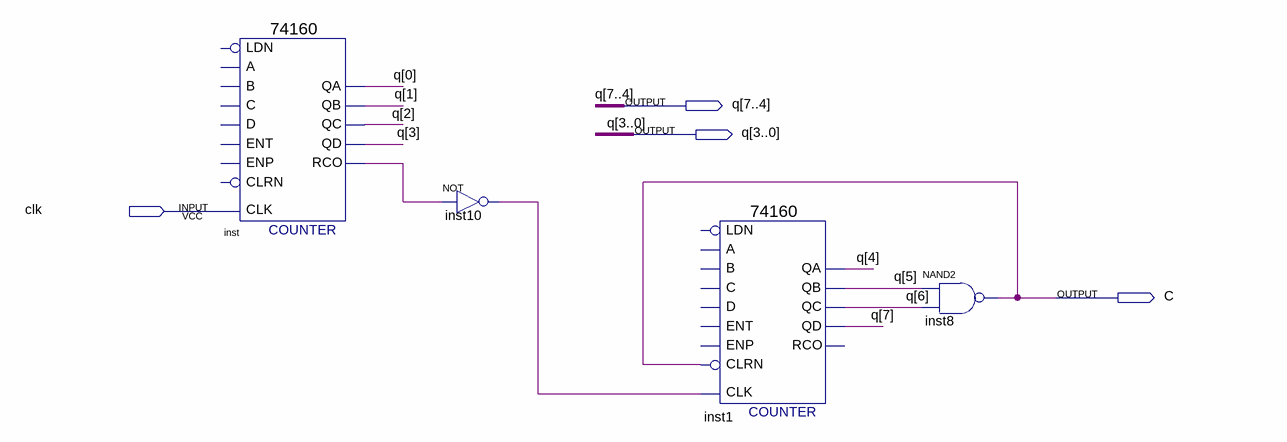
[diagram p0: schematic sheet]
// Quartus schematic counter_60_160.bdf as structural Verilog: 4 symbols, 4 pins
module counter_60_160 (
  input  clk,
  output [7:0] q,
  output C
);

  wire inst10_out, inst_rco;

  \74160  inst (
    .CLK(clk), .QD(q[3]), .QA(q[0]), .QB(q[1]), .QC(q[2]), .RCO(inst_rco));  // open: ENT, A, B, C, D, LDN, ENP, CLRN
  not inst10 (inst10_out, inst_rco);
  \74160  inst1 (
    .CLK(inst10_out), .CLRN(C), .QD(q[7]), .QA(q[4]), .QB(q[5]), .QC(q[6]));  // open: ENT, A, B, C, D, LDN, ENP, RCO
  nand inst8 (C, q[5], q[6]);
endmodule
